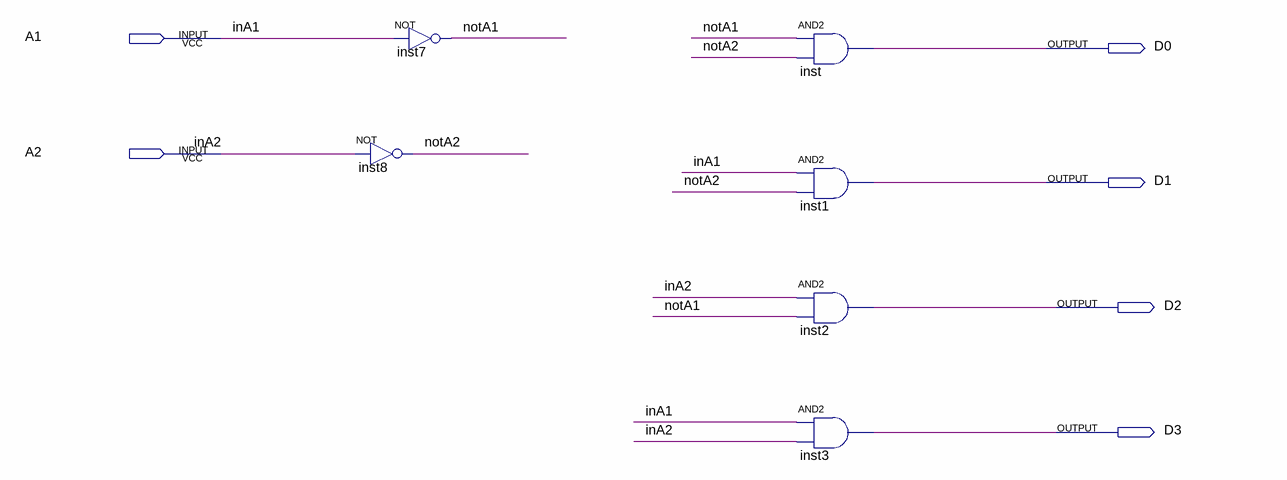
[diagram p0: schematic sheet]
// Quartus schematic ex1p2.bdf as structural Verilog: 6 symbols, 6 pins
module ex1p2 (
  input  A1,
  input  A2,
  output D0,
  output D1,
  output D2,
  output D3
);

  wire notA1, notA2;

  not inst7 (notA1, A1);
  not inst8 (notA2, A2);
  and inst (D0, notA1, notA2);
  and inst1 (D1, A1, notA2);
  and inst2 (D2, A2, notA1);
  and inst3 (D3, A1, A2);

  // Other names for the same wires on the sheet: inA1 = A1; inA2 = A2
endmodule
